# Altium schematic sheet Master-Slave.SchDoc: NEOS Master/Slave Electronics
size D; PageSetup: Record=PageOptions|CenterHorizontal=True|CenterVertical=True|PrintScale=0.34|XCorrection=1.00|YCorrection=1.00|PrintKind=1|BorderSize=5000000|LeftOffset=0|BottomOffset=0|Orientation=2|PaperLength=1000|PaperWidth=1000|Scale=100|PaperSource=15|PrintQuality=1200|MediaType=1|DitherType=10|PaperKind=Letter|PrintScaleMode=1
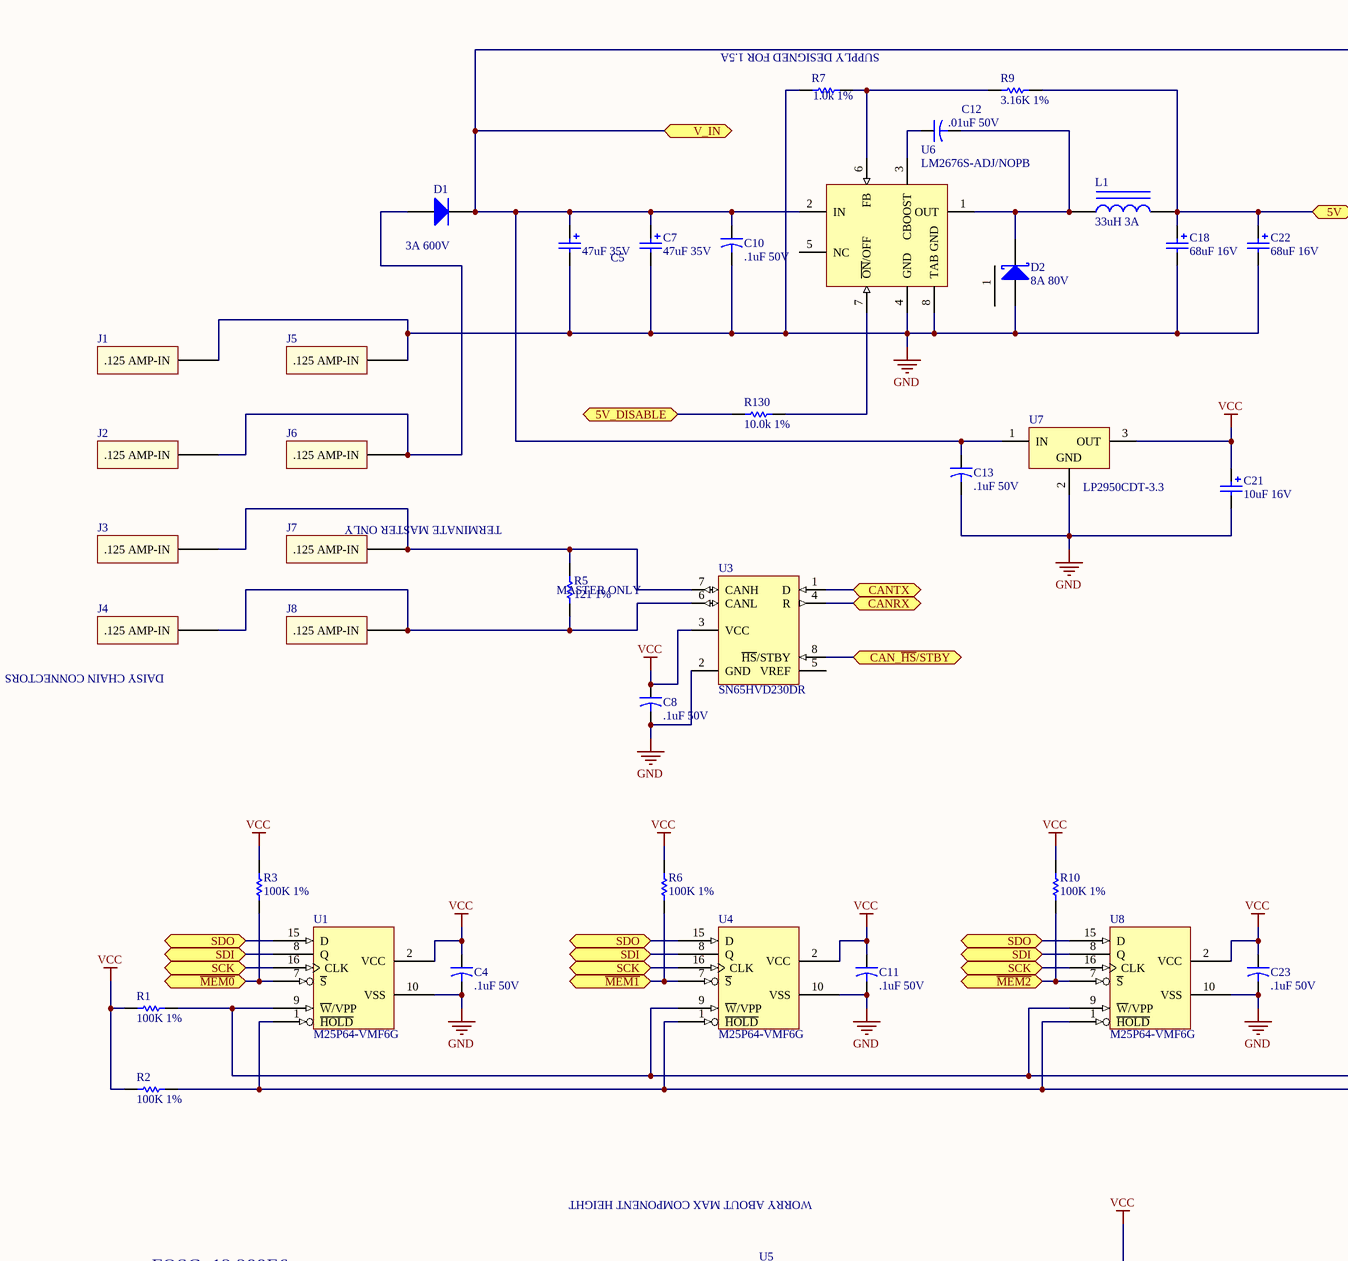
[diagram p0: Master-Slave.SchDoc, top left]
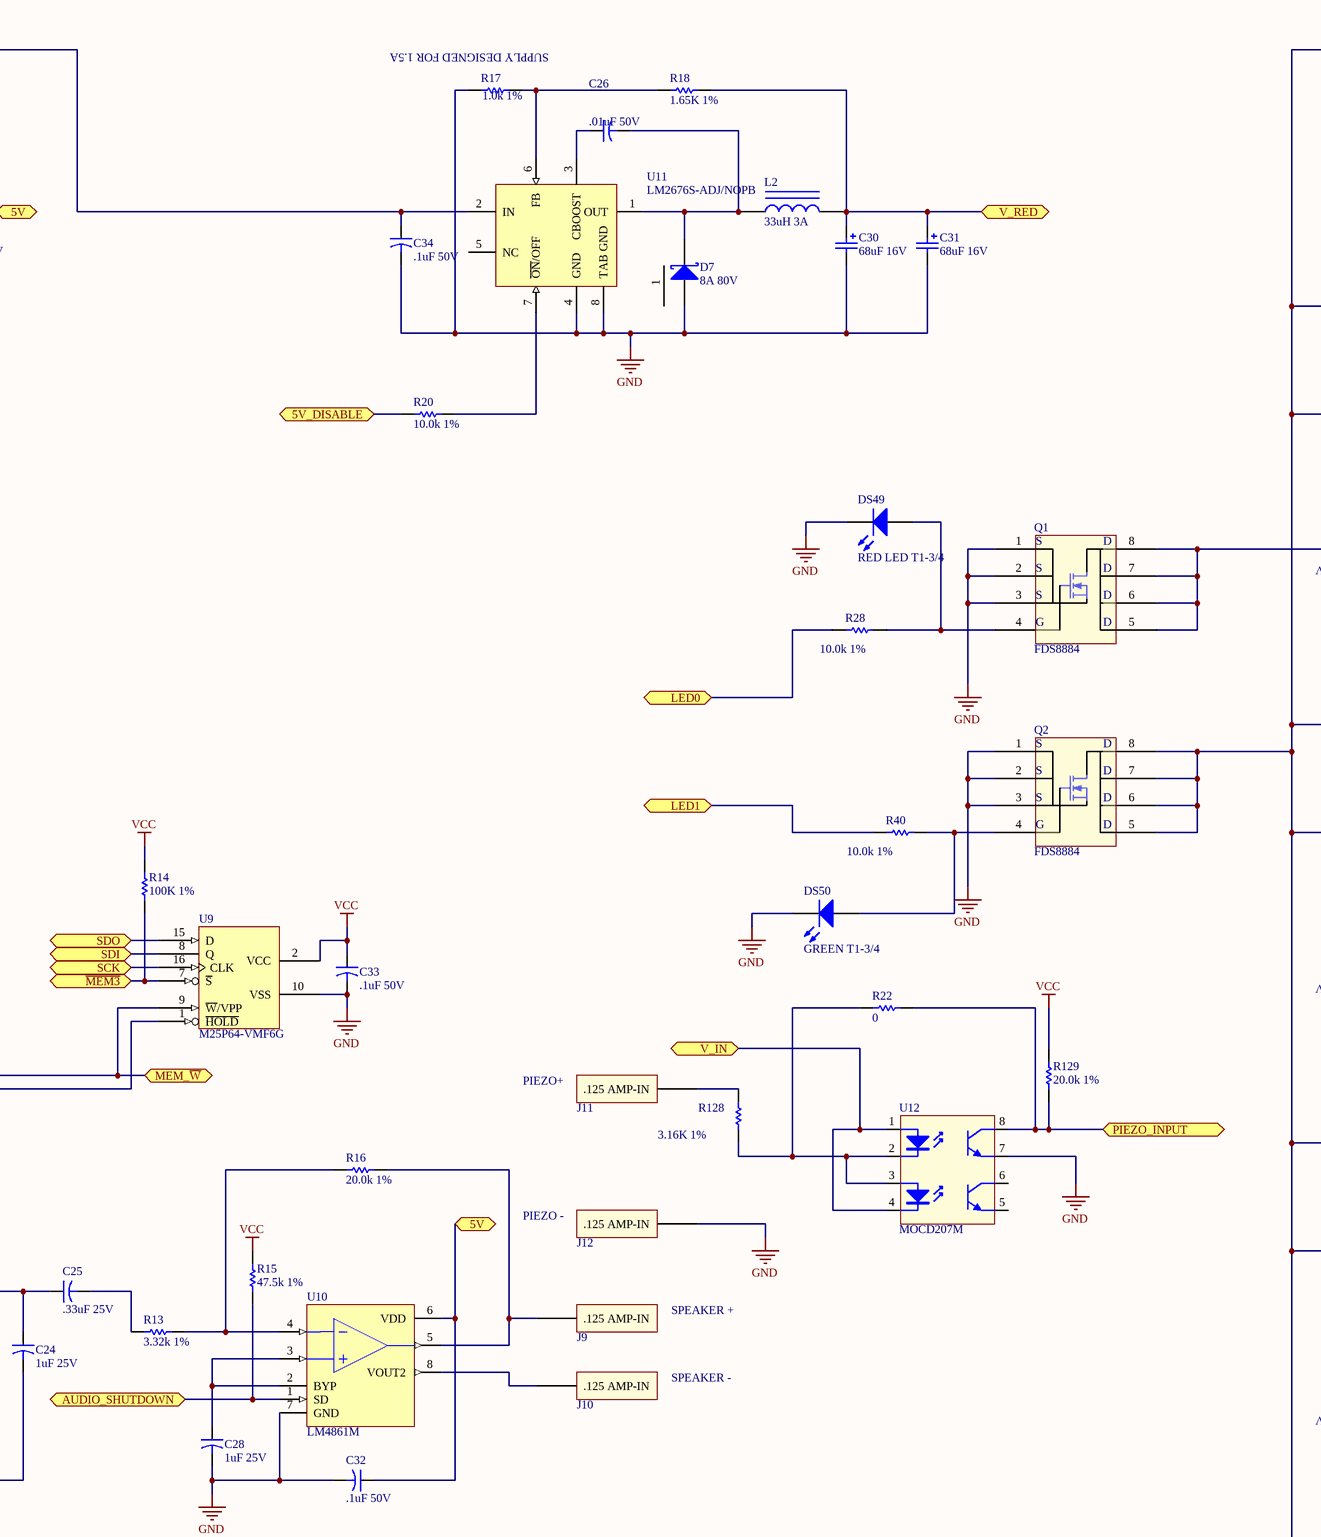
[diagram p1: Master-Slave.SchDoc, top middle]
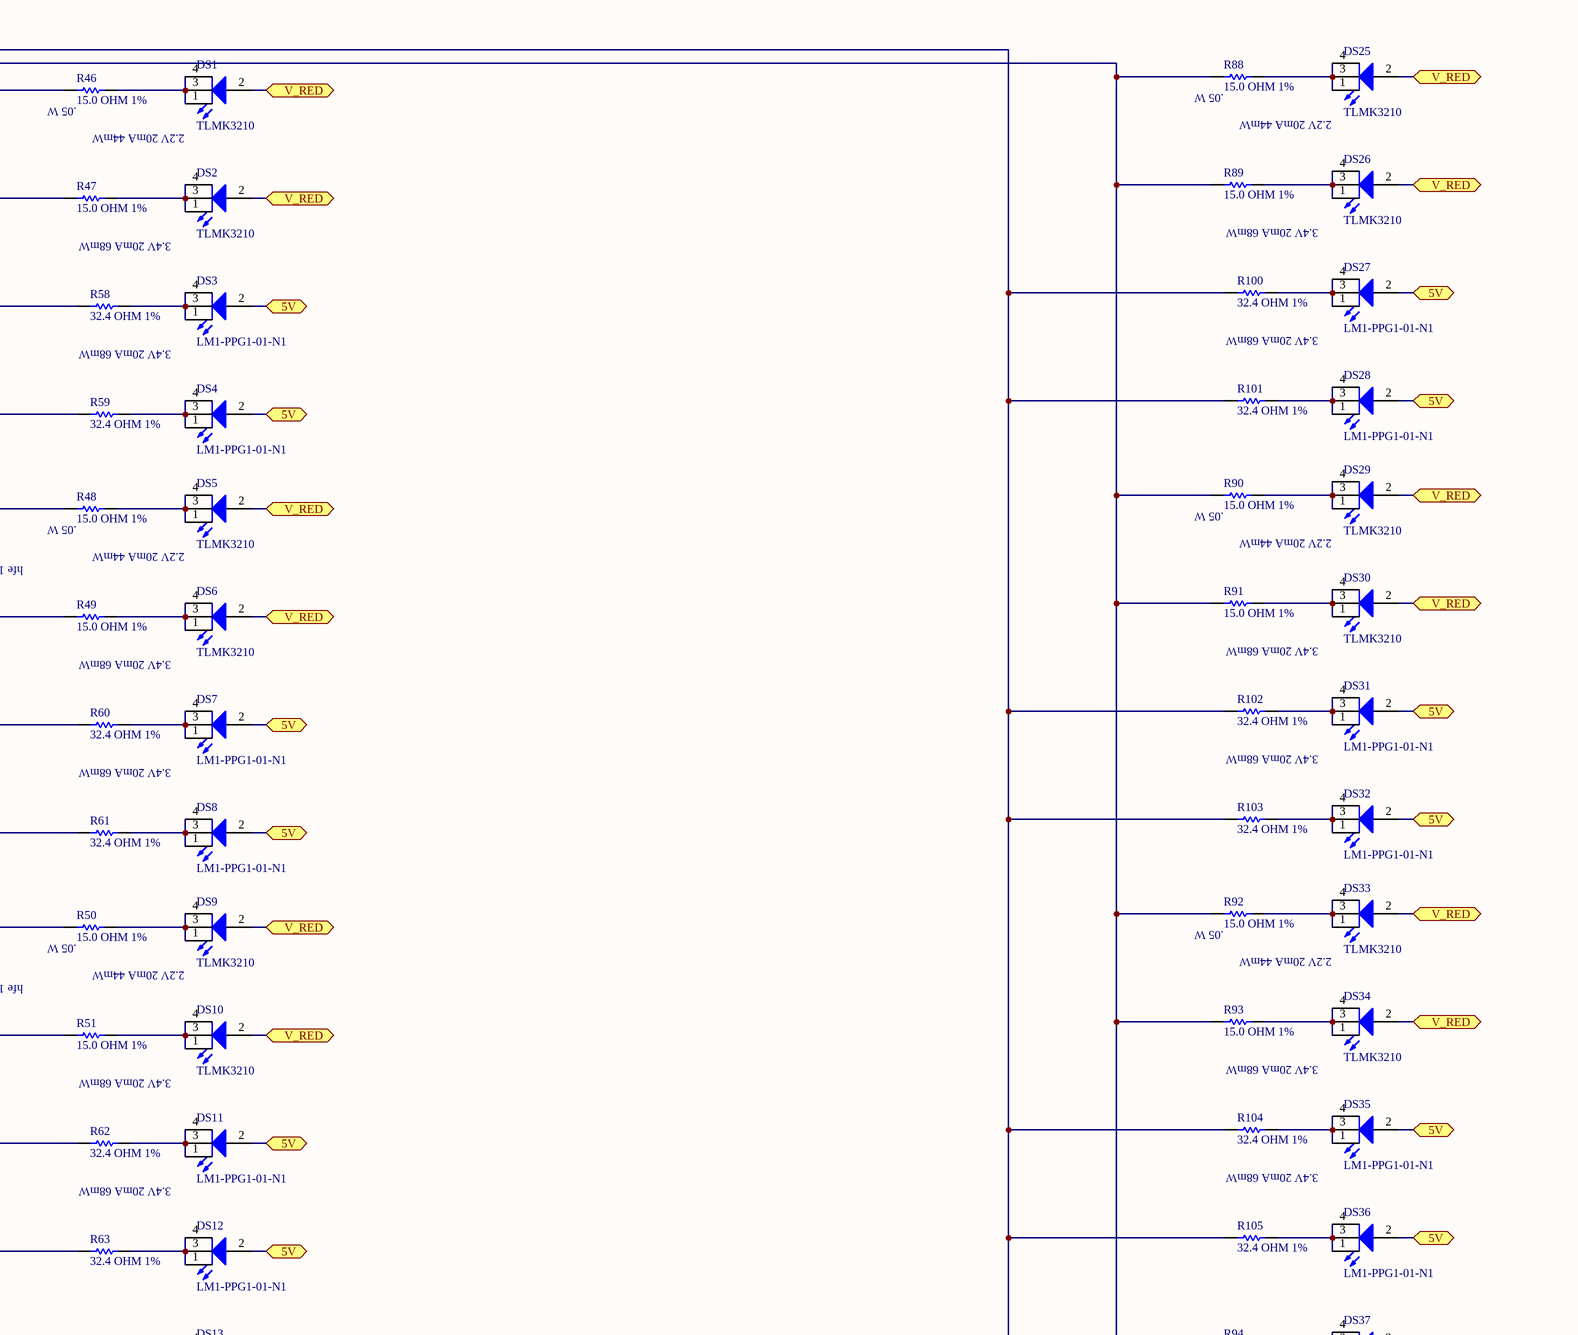
[diagram p2: Master-Slave.SchDoc, top right]
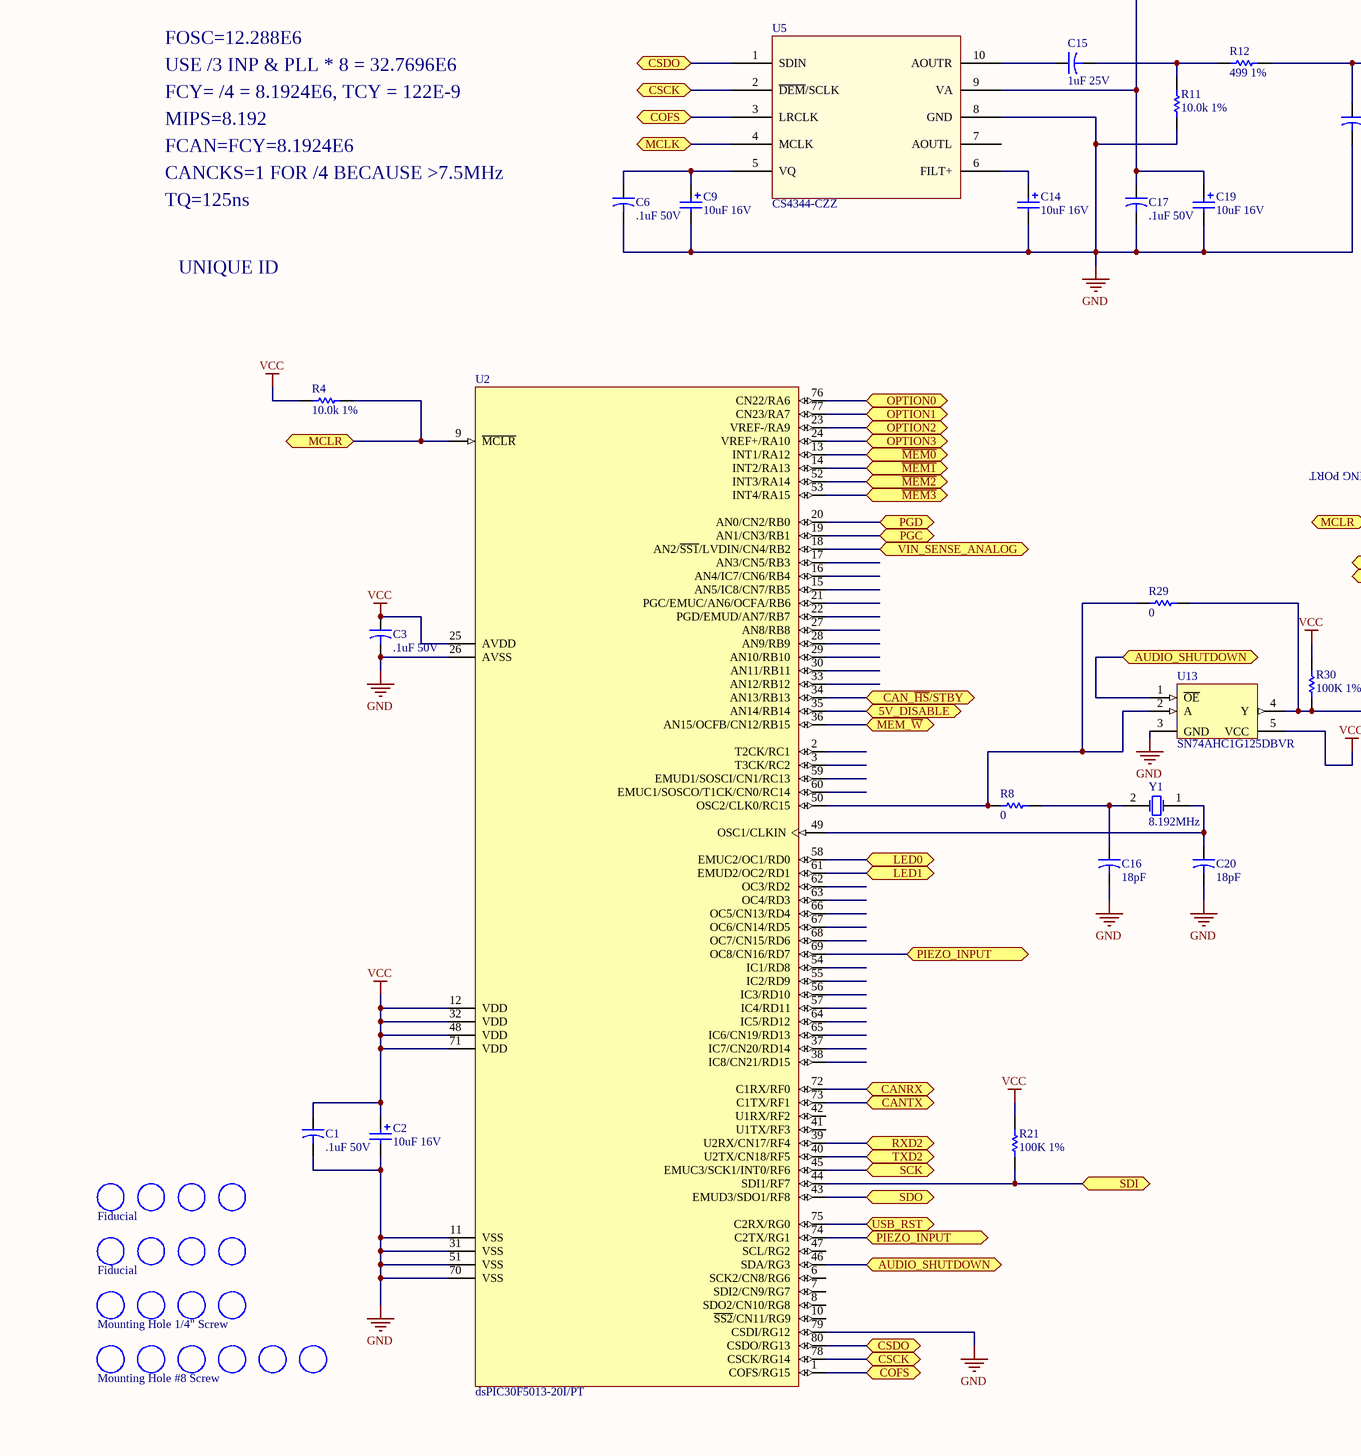
[diagram p3: Master-Slave.SchDoc, bottom left]
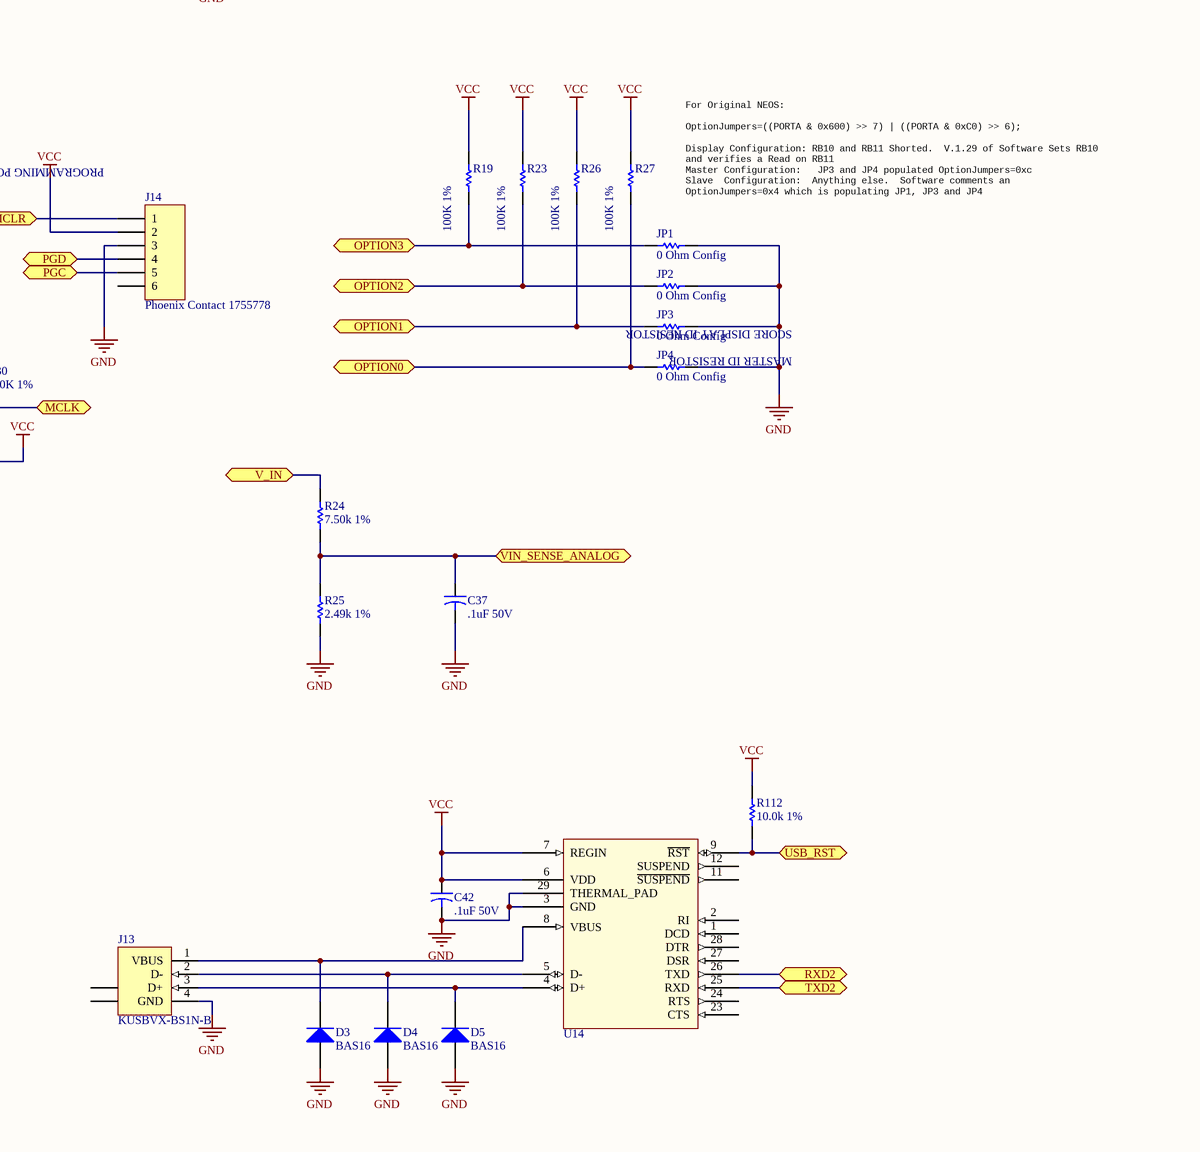
[diagram p4: Master-Slave.SchDoc, bottom middle]
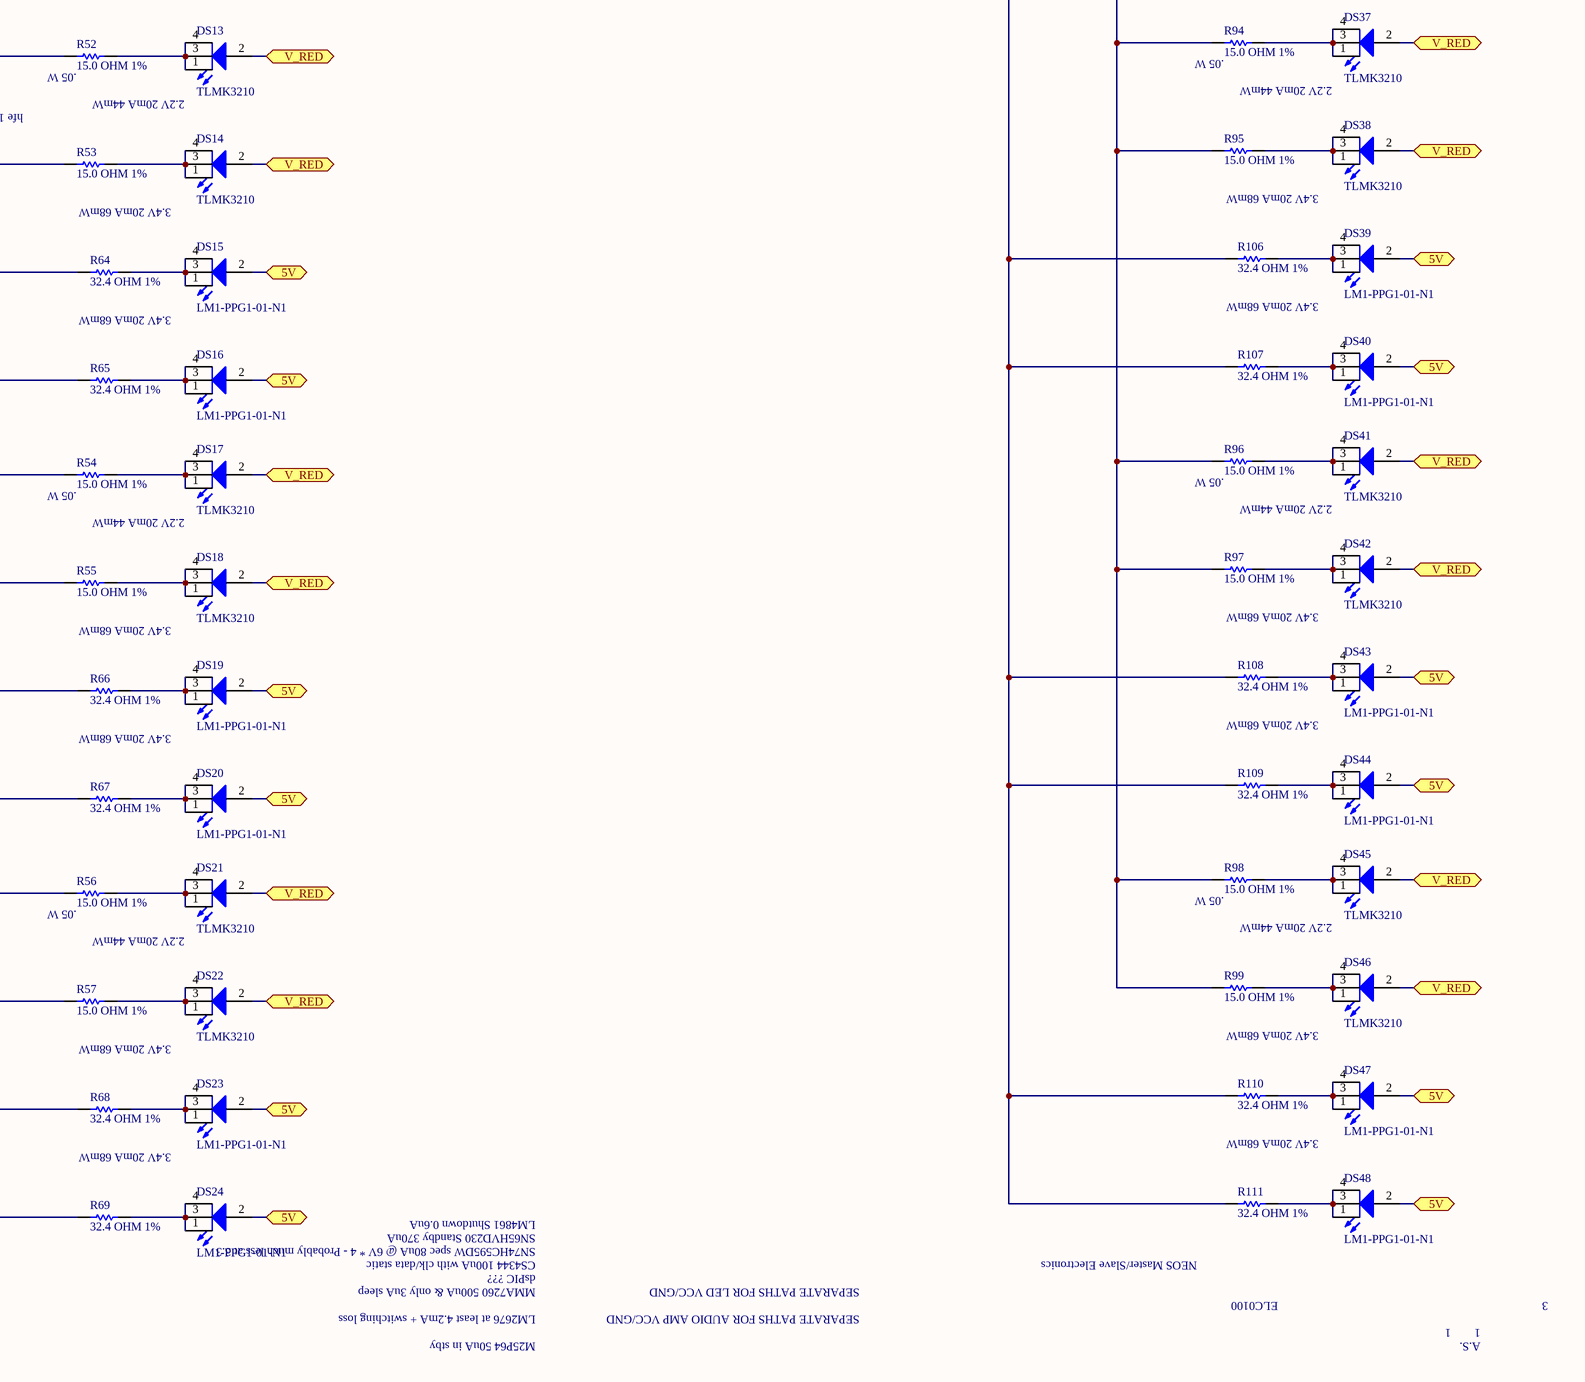
[diagram p5: Master-Slave.SchDoc, bottom right]

## Parts
C1  .1uF 50V  [C0805]
C2  10uF 16V  [C4X5.8]
C3  .1uF 50V  [C0805]
C4  .1uF 50V  [C0805]
C5  47uF 35V  [CAPACITOR TANT 47UF 35V 10% SMD 7343-43 (EIA]
C6  .1uF 50V  [C0805]
C7  47uF 35V  [CAPACITOR TANT 47UF 35V 10% SMD 7343-43 (EIA]
C8  .1uF 50V  [C0805]
C9  10uF 16V  [C4X5.8]
C10  .1uF 50V  [C0805]
C11  .1uF 50V  [C0805]
C12  .01uF 50V  [C0805]
C13  .1uF 50V  [C0805]
C14  10uF 16V  [C4X5.8]
C15  1uF 25V  [R1206]
C16  18pF  [C0805]
C17  .1uF 50V  [C0805]
C18  68uF 16V  [C7343]
C19  10uF 16V  [C4X5.8]
C20  18pF  [C0805]
C21  10uF 16V  [C4X5.8]
C22  68uF 16V  [C7343]
C23  .1uF 50V  [C0805]
C24  1uF 25V  [R1206]
C25  .33uF 25V  [R1206]
C26  .01uF 50V  [C0805]
C28  1uF 25V  [R1206]
C30  68uF 16V  [D]
C31  68uF 16V  [C7343]
C32  .1uF 50V  [C0805]
C33  .1uF 50V  [C0805]
C34  .1uF 50V  [C0805]
C37  .1uF 50V  [C0805]
C42  .1uF 50V  [C0805]
D1  value 3A 600V  [DIODE_SMC]  (hidden comment: DIODE ULTRA FAST 3A 600V SMC)
D2  8A 80V  [D2PAK]
D3  BAS16  [SOT23]
D4  BAS16  [SOT23]
D5  BAS16  [SOT23]
D7  8A 80V  [D2PAK]
DS1  TLMK3210  [L#S/TLMK3210Z]
DS2  TLMK3210  [L#S/TLMK3210Z]
DS3  LM1-PPG1-01-N1  [L#S/TLMK3210Z]
DS4  LM1-PPG1-01-N1  [L#S/TLMK3210Z]
DS5  TLMK3210  [L#S/TLMK3210Z]
DS6  TLMK3210  [L#S/TLMK3210Z]
DS7  LM1-PPG1-01-N1  [L#S/TLMK3210Z]
DS8  LM1-PPG1-01-N1  [L#S/TLMK3210Z]
DS9  TLMK3210  [L#S/TLMK3210Z]
DS10  TLMK3210  [L#S/TLMK3210Z]
DS11  LM1-PPG1-01-N1  [L#S/TLMK3210Z]
DS12  LM1-PPG1-01-N1  [L#S/TLMK3210Z]
DS13  TLMK3210  [L#S/TLMK3210Z]
DS14  TLMK3210  [L#S/TLMK3210Z]
DS15  LM1-PPG1-01-N1  [L#S/TLMK3210Z]
DS16  LM1-PPG1-01-N1  [L#S/TLMK3210Z]
DS17  TLMK3210  [L#S/TLMK3210Z]
DS18  TLMK3210  [L#S/TLMK3210Z]
DS19  LM1-PPG1-01-N1  [L#S/TLMK3210Z]
DS20  LM1-PPG1-01-N1  [L#S/TLMK3210Z]
DS21  TLMK3210  [L#S/TLMK3210Z]
DS22  TLMK3210  [L#S/TLMK3210Z]
DS23  LM1-PPG1-01-N1  [L#S/TLMK3210Z]
DS24  LM1-PPG1-01-N1  [L#S/TLMK3210Z]
DS25  TLMK3210  [L#S/TLMK3210Z]
DS26  TLMK3210  [L#S/TLMK3210Z]
DS27  LM1-PPG1-01-N1  [L#S/TLMK3210Z]
DS28  LM1-PPG1-01-N1  [L#S/TLMK3210Z]
DS29  TLMK3210  [L#S/TLMK3210Z]
DS30  TLMK3210  [L#S/TLMK3210Z]
DS31  LM1-PPG1-01-N1  [L#S/TLMK3210Z]
DS32  LM1-PPG1-01-N1  [L#S/TLMK3210Z]
DS33  TLMK3210  [L#S/TLMK3210Z]
DS34  TLMK3210  [L#S/TLMK3210Z]
DS35  LM1-PPG1-01-N1  [L#S/TLMK3210Z]
DS36  LM1-PPG1-01-N1  [L#S/TLMK3210Z]
DS37  TLMK3210  [L#S/TLMK3210Z]
DS38  TLMK3210  [L#S/TLMK3210Z]
DS39  LM1-PPG1-01-N1  [L#S/TLMK3210Z]
DS40  LM1-PPG1-01-N1  [L#S/TLMK3210Z]
DS41  TLMK3210  [L#S/TLMK3210Z]
DS42  TLMK3210  [L#S/TLMK3210Z]
DS43  LM1-PPG1-01-N1  [L#S/TLMK3210Z]
DS44  LM1-PPG1-01-N1  [L#S/TLMK3210Z]
DS45  TLMK3210  [L#S/TLMK3210Z]
DS46  TLMK3210  [L#S/TLMK3210Z]
DS47  LM1-PPG1-01-N1  [L#S/TLMK3210Z]
DS48  LM1-PPG1-01-N1  [L#S/TLMK3210Z]
DS49  RED LED T1-3/4  [LED T1-3/4 Flush]
DS50  GREEN T1-3/4  [LED T1-3/4 Flush]
FID1  Fiducial  [Fiducial]  (no BOM)
FID2  Fiducial  [Fiducial]  (value not drawn)  (no BOM)
FID3  Fiducial  [Fiducial]  (value not drawn)  (no BOM)
FID4  Fiducial  [Fiducial]  (value not drawn)  (no BOM)
FID5  Fiducial  [Fiducial]  (no BOM)
FID6  Fiducial  [Fiducial]  (value not drawn)  (no BOM)
FID7  Fiducial  [Fiducial]  (value not drawn)  (no BOM)
FID8  Fiducial  [Fiducial]  (value not drawn)  (no BOM)
J1  *  [WIRE_125]  (value not drawn)  (no BOM)
J2  *  [WIRE_125]  (value not drawn)  (no BOM)
J3  *  [WIRE_125]  (value not drawn)  (no BOM)
J4  *  [WIRE_125]  (value not drawn)  (no BOM)
J5  *  [WIRE_125]  (value not drawn)  (no BOM)
J6  *  [WIRE_125]  (value not drawn)  (no BOM)
J7  *  [WIRE_125]  (value not drawn)  (no BOM)
J8  *  [WIRE_125]  (value not drawn)  (no BOM)
J9  *  [WIRE_125]  (value not drawn)  (no BOM)
J10  *  [WIRE_125]  (value not drawn)  (no BOM)
J11  *  [WIRE_125]  (value not drawn)  (no BOM)
J12  *  [WIRE_125]  (value not drawn)  (no BOM)
J13  KUSBVX-BS1N-B  [KUSBVX-BS1N]
J14  Phoenix Contact 1755778  [JCPM5086VE0Z]
JP1  0 Ohm Config
JP2  0 Ohm Config
JP3  0 Ohm Config
JP4  0 Ohm Config  [0805]
L1  33uH 3A  [IND/DO5022]
L2  33uH 3A  [IND/DO5022]
M1  Mounting Hole 1/4" Screw  [MHole250]  (no BOM)
M2  Mounting Hole 1/4" Screw  [MHole250]  (value not drawn)  (no BOM)
M3  Mounting Hole 1/4" Screw  [MHole250]  (value not drawn)  (no BOM)
M4  Mounting Hole 1/4" Screw  [MHole250]  (value not drawn)  (no BOM)
M5  Mounting Hole #8 Screw  [MHole#8]  (no BOM)
M6  Mounting Hole #8 Screw  [MHole#8]  (value not drawn)  (no BOM)
M7  Mounting Hole #8 Screw  [MHole#8]  (value not drawn)  (no BOM)
M8  Mounting Hole #8 Screw  [MHole#8]  (value not drawn)  (no BOM)
M9  Mounting Hole #8 Screw  [MHole#8]  (value not drawn)  (no BOM)
M10  Mounting Hole #8 Screw  [MHole#8]  (value not drawn)  (no BOM)
Q1  FDS8884  [SO8]
Q2  FDS8884  [SO8]
R1  100K 1%  [R0805]
R2  100K 1%  [R0805]
R3  100K 1%  [R0805]
R4  10.0k 1%  [R0805]
R5  121 1%  [R1206]
R6  100K 1%  [R0805]
R7  1.0k 1%  [R0805]
R8  0  [R0805]
R9  3.16K 1%  [R0805]
R10  100K 1%  [R0805]
R11  10.0k 1%  [R0805]
R12  499 1%  [R0805]
R13  3.32k 1%  [R0805]
R14  100K 1%  [R0805]
R15  47.5k 1%  [R0805]
R16  20.0k 1%  [R0805]
R17  1.0k 1%  [R0805]
R18  1.65K 1%  [R0805]
R19  100K 1%  [R0805]
R20  10.0k 1%  [R0805]
R21  100K 1%  [R0805]
R22  0  [R0805]
R23  100K 1%  [R0805]
R24  7.50k 1%  [R0805]
R25  2.49k 1%
R26  100K 1%  [R0805]
R27  100K 1%  [R0805]
R28  10.0k 1%  [R0805]
R29  0  [R0805]
R30  100K 1%  [R0805]
R40  10.0k 1%  [R0805]
R46  15.0 OHM 1%  [R1206]
R47  15.0 OHM 1%  [R1206]
R48  15.0 OHM 1%  [R1206]
R49  15.0 OHM 1%  [R1206]
R50  15.0 OHM 1%  [R1206]
R51  15.0 OHM 1%  [R1206]
R52  15.0 OHM 1%  [R1206]
R53  15.0 OHM 1%  [R1206]
R54  15.0 OHM 1%  [R1206]
R55  15.0 OHM 1%  [R1206]
R56  15.0 OHM 1%  [R1206]
R57  15.0 OHM 1%  [R1206]
R58  32.4 OHM 1%  [R1206]
R59  32.4 OHM 1%  [R1206]
R60  32.4 OHM 1%  [R1206]
R61  32.4 OHM 1%  [R1206]
R62  32.4 OHM 1%  [R1206]
R63  32.4 OHM 1%  [R1206]
R64  32.4 OHM 1%  [R1206]
R65  32.4 OHM 1%  [R1206]
R66  32.4 OHM 1%  [R1206]
R67  32.4 OHM 1%  [R1206]
R68  32.4 OHM 1%  [R1206]
R69  32.4 OHM 1%  [R1206]
R88  15.0 OHM 1%  [R1206]
R89  15.0 OHM 1%  [R1206]
R90  15.0 OHM 1%  [R1206]
R91  15.0 OHM 1%  [R1206]
R92  15.0 OHM 1%  [R1206]
R93  15.0 OHM 1%  [R1206]
R94  15.0 OHM 1%  [R1206]
R95  15.0 OHM 1%  [R1206]
R96  15.0 OHM 1%  [R1206]
R97  15.0 OHM 1%  [R1206]
R98  15.0 OHM 1%  [R1206]
R99  15.0 OHM 1%  [R1206]
R100  32.4 OHM 1%  [R1206]
R101  32.4 OHM 1%  [R1206]
R102  32.4 OHM 1%  [R1206]
R103  32.4 OHM 1%  [R1206]
R104  32.4 OHM 1%  [R1206]
R105  32.4 OHM 1%  [R1206]
R106  32.4 OHM 1%  [R1206]
R107  32.4 OHM 1%  [R1206]
R108  32.4 OHM 1%  [R1206]
R109  32.4 OHM 1%  [R1206]
R110  32.4 OHM 1%  [R1206]
R111  32.4 OHM 1%  [R1206]
R112  10.0k 1%  [R0805]
R128  3.16K 1%  [R0805]
R129  20.0k 1%  [R0805]
R130  10.0k 1%  [R0805]
U1  M25P64-VMF6G  [so16w]
U2  dsPIC30F5013-20I/PT  [TQFP-80]
U3  SN65HVD230DR  [SOIC 8]
U4  M25P64-VMF6G  [so16w]
U5  CS4344-CZZ  [TSSOP\10]
U6  LM2676S-ADJ/NOPB  [TO263\7]
U7  LP2950CDT-3.3  [D-PAK / TO-252AA]
U8  M25P64-VMF6G  [so16w]
U9  M25P64-VMF6G  [so16w]
U10  LM4861M  [M08A]
U11  LM2676S-ADJ/NOPB  [TO263\7]
U12  MOCD207M  [SOIC 8]
U13  SN74AHC1G125DBVR  [SOT23-5]
U14  IC USB-TO-UART BRIDGE 28MLP  [QFN-28]  (value not drawn)
Y1  8.192MHz  [XTSL\CSM-7]

## Ports
5V, 5V_DISABLE, AUDIO_SHUTDOWN, CAN_~{HS}/STBY, CANRX, CANTX, COFS, CSCK, CSDO, LED0, LED1, MCLK, MCLR, MEM_~{W}, OPTION0, OPTION1, OPTION2, OPTION3, PGC, PGD, PIEZO_INPUT, RXD2, SCK, SDI, SDO, TXD2, USB_RST, V_IN, V_RED, VIN_SENSE_ANALOG, ~{MEM0}, ~{MEM1}, ~{MEM2}, ~{MEM3}

## Nets
GND: C1.2 C2.2 C3.2 C4.2 C5.2 C6.2 C7.2 C8.2 C9.2 C10.2 C11.2 C13.2 C14.2 C16.2 C17.2 C18.2 C19.2 C20.2 C21.2 C22.2 C23.2 C24.2 C28.2 C30.2 C31.2 C32.2 C33.2 C34.2 C37.2 C42.2 D2.3(A) D3.1(A) D4.1(A) D5.1(A) D7.3(A) DS49.2(K) DS50.2(K) J1.1(.125_AMP-IN) J5.1(.125_AMP-IN) J12.1(.125_AMP-IN) J13.4(GND) J14.3 JP1.2 JP2.2 JP3.2 JP4.2 Q1.1(S) Q1.2(S) Q1.3(S) Q2.1(S) Q2.2(S) Q2.3(S) R7.1 R11.1 R17.1 R25.1 U1.10(VSS) U2.11(VSS) U2.26(AVSS) U2.31(VSS) U2.51(VSS) U2.70(VSS) U2.79(CSDI/RG12) U3.2(GND) U4.10(VSS) U5.8(GND) U6.4(GND) U6.8(TAB_GND) U7.2(GND) U8.10(VSS) U9.10(VSS) U10.7(GND) U11.4(GND) U11.8(TAB_GND) U12.7 U13.3(GND) U14.3(GND) U14.29(THERMAL_PAD)
VCC: C1.1 C2.1 C3.1 C4.1 C8.1 C11.1 C17.1 C19.1 C21.1 C23.1 C33.1 C42.1 J14.2 R1.1 R2.1 R3.2 R4.2 R6.2 R10.2 R14.2 R15.2 R19.2 R21.2 R23.2 R26.2 R27.2 R30.2 R112.2 R129.2 U1.2(VCC) U2.12(VDD) U2.25(AVDD) U2.32(VDD) U2.48(VDD) U2.71(VDD) U3.3(VCC) U4.2(VCC) U5.9(VA) U7.3(OUT) U8.2(VCC) U9.2(VCC) U13.5(VCC) U14.6(VDD) U14.7(REGIN)
5V: C18.1 C22.1 C32.1 DS3.2(A) DS4.2(A) DS7.2(A) DS8.2(A) DS11.2(A) DS12.2(A) DS15.2(A) DS16.2(A) DS19.2(A) DS20.2(A) DS23.2(A) DS24.2(A) DS27.2(A) DS28.2(A) DS31.2(A) DS32.2(A) DS35.2(A) DS36.2(A) DS39.2(A) DS40.2(A) DS43.2(A) DS44.2(A) DS47.2(A) DS48.2(A) L1.2 R9.2 U10.6(VDD) ; port 5V
5V_DISABLE: R20.1 R130.1 U2.35(AN14/RB14) ; port 5V_DISABLE
AUDIO_SHUTDOWN: R15.1 U2.46(SDA/RG3) U10.1(SD) U13.1(~{OE}) ; port AUDIO_SHUTDOWN
CAN_~{HS}/STBY: U2.34(AN13/RB13) U3.8(~{HS}/STBY) ; port CAN_~{HS}/STBY
CANRX: U2.72(C1RX/RF0) U3.4(R) ; port CANRX
CANTX: U2.73(C1TX/RF1) U3.1(D) ; port CANTX
COFS: U2.1(COFS/RG15) U5.3(LRCLK) ; port COFS
CSCK: U2.78(CSCK/RG14) U5.2(~{DEM}/SCLK) ; port CSCK
CSDO: U2.80(CSDO/RG13) U5.1(SDIN) ; port CSDO
LED0: R28.1 U2.58(EMUC2/OC1/RD0) ; port LED0
LED1: R40.1 U2.61(EMUD2/OC2/RD1) ; port LED1
~{MEM0}: R3.1 U1.7(~{S}) U2.13(INT1/RA12) ; port ~{MEM0}
~{MEM1}: R6.1 U2.14(INT2/RA13) U4.7(~{S}) ; port ~{MEM1}
~{MEM2}: R10.1 U2.52(INT3/RA14) U8.7(~{S}) ; port ~{MEM2}
~{MEM3}: R14.1 U2.53(INT4/RA15) U9.7(~{S}) ; port ~{MEM3}
MCLK: R29.2 R30.1 U5.4(MCLK) U13.4(Y) ; port MCLK
MCLR: J14.1 R4.1 U2.9(~{MCLR}) ; port MCLR
MEM_~{W}: R1.2 U1.9(~{W}/VPP) U2.36(AN15/OCFB/CN12/RB15) U4.9(~{W}/VPP) U8.9(~{W}/VPP) U9.9(~{W}/VPP) ; port MEM_~{W}
OPTION0: JP4.1 R27.1 U2.76(CN22/RA6) ; port OPTION0
OPTION1: JP3.1 R26.1 U2.77(CN23/RA7) ; port OPTION1
OPTION2: JP2.1 R23.1 U2.23(VREF-/RA9) ; port OPTION2
OPTION3: JP1.1 R19.1 U2.24(VREF+/RA10) ; port OPTION3
PGC: J14.5 U2.19(AN1/CN3/RB1) ; port PGC
PGD: J14.4 U2.20(AN0/CN2/RB0) ; port PGD
PIEZO_INPUT: R22.2 R129.1 U2.69(OC8/CN16/RD7) U2.74(C2TX/RG1) U12.8 ; port PIEZO_INPUT
RXD2: U2.39(U2RX/CN17/RF4) U14.26(TXD) ; port RXD2
SCK: U1.16(CLK) U2.45(EMUC3/SCK1/INT0/RF6) U4.16(CLK) U8.16(CLK) U9.16(CLK) ; port SCK
SDI: R21.1 U1.8(Q) U2.44(SDI1/RF7) U4.8(Q) U8.8(Q) U9.8(Q) ; port SDI
SDO: U1.15(D) U2.43(EMUD3/SDO1/RF8) U4.15(D) U8.15(D) U9.15(D) ; port SDO
TXD2: U2.40(U2TX/CN18/RF5) U14.25(RXD) ; port TXD2
USB_RST: R112.1 U2.75(C2RX/RG0) U14.9(~{RST}) ; port USB_RST
V_IN: C5.1 C7.1 C10.1 C13.1 C34.1 D1.K R24.2 U6.2(IN) U7.1(IN) U11.2(IN) U12.1 U12.4 ; port V_IN
V_RED: C30.1 C31.1 DS1.2(A) DS2.2(A) DS5.2(A) DS6.2(A) DS9.2(A) DS10.2(A) DS13.2(A) DS14.2(A) DS17.2(A) DS18.2(A) DS21.2(A) DS22.2(A) DS25.2(A) DS26.2(A) DS29.2(A) DS30.2(A) DS33.2(A) DS34.2(A) DS37.2(A) DS38.2(A) DS41.2(A) DS42.2(A) DS45.2(A) DS46.2(A) L2.2 R18.2 ; port V_RED
VIN_SENSE_ANALOG: C37.1 R24.1 R25.2 U2.18(AN2/~{SS1}/LVDIN/CN4/RB2) ; port VIN_SENSE_ANALOG
NetC6_1: C6.1 C9.1 U5.5(VQ)
NetC12_1: C12.1 U6.3(CBOOST)
NetC12_2: C12.2 D2.2(K) L1.1 U6.1(OUT)
NetC14_1: C14.1 U5.6(FILT+)
NetC15_1: C15.1 U5.10(AOUTR)
NetC15_2: C15.2 R11.2 R12.1
NetC16_1: C16.1 R8.2 Y1.2(OSC2)
NetC20_1: C20.1 U2.49(OSC1/CLKIN) Y1.1(OSC1)
NetC24_1: C24.1 C25.1 R12.2
NetC25_2: C25.2 R13.1
NetC26_1: C26.1 U11.3(CBOOST)
NetC26_2: C26.2 D7.2(K) L2.1 U11.1(OUT)
NetC28_1: C28.1 U10.2(BYP) U10.3(IN+)
NetD1_A: D1.A J2.1(.125_AMP-IN) J6.1(.125_AMP-IN)
NetD3_3: D3.3(K) J13.1(VBUS) U14.8(VBUS)
NetD4_3: D4.3(K) J13.2(D-) U14.5(D-)
NetD5_3: D5.3(K) J13.3(D+) U14.4(D+)
NetDS1_1: DS1.1(K) DS1.3(K) DS1.4(K) R46.2
NetDS2_1: DS2.1(K) DS2.3(K) DS2.4(K) R47.2
NetDS3_1: DS3.1(K) DS3.3(K) DS3.4(K) R58.2
NetDS4_1: DS4.1(K) DS4.3(K) DS4.4(K) R59.2
NetDS5_1: DS5.1(K) DS5.3(K) DS5.4(K) R48.2
NetDS6_1: DS6.1(K) DS6.3(K) DS6.4(K) R49.2
NetDS7_1: DS7.1(K) DS7.3(K) DS7.4(K) R60.2
NetDS8_1: DS8.1(K) DS8.3(K) DS8.4(K) R61.2
NetDS9_1: DS9.1(K) DS9.3(K) DS9.4(K) R50.2
NetDS10_1: DS10.1(K) DS10.3(K) DS10.4(K) R51.2
NetDS11_1: DS11.1(K) DS11.3(K) DS11.4(K) R62.2
NetDS12_1: DS12.1(K) DS12.3(K) DS12.4(K) R63.2
NetDS13_1: DS13.1(K) DS13.3(K) DS13.4(K) R52.2
NetDS14_1: DS14.1(K) DS14.3(K) DS14.4(K) R53.2
NetDS15_1: DS15.1(K) DS15.3(K) DS15.4(K) R64.2
NetDS16_1: DS16.1(K) DS16.3(K) DS16.4(K) R65.2
NetDS17_1: DS17.1(K) DS17.3(K) DS17.4(K) R54.2
NetDS18_1: DS18.1(K) DS18.3(K) DS18.4(K) R55.2
NetDS19_1: DS19.1(K) DS19.3(K) DS19.4(K) R66.2
NetDS20_1: DS20.1(K) DS20.3(K) DS20.4(K) R67.2
NetDS21_1: DS21.1(K) DS21.3(K) DS21.4(K) R56.2
NetDS22_1: DS22.1(K) DS22.3(K) DS22.4(K) R57.2
NetDS23_1: DS23.1(K) DS23.3(K) DS23.4(K) R68.2
NetDS24_1: DS24.1(K) DS24.3(K) DS24.4(K) R69.2
NetDS25_1: DS25.1(K) DS25.3(K) DS25.4(K) R88.2
NetDS26_1: DS26.1(K) DS26.3(K) DS26.4(K) R89.2
NetDS27_1: DS27.1(K) DS27.3(K) DS27.4(K) R100.2
NetDS28_1: DS28.1(K) DS28.3(K) DS28.4(K) R101.2
NetDS29_1: DS29.1(K) DS29.3(K) DS29.4(K) R90.2
NetDS30_1: DS30.1(K) DS30.3(K) DS30.4(K) R91.2
NetDS31_1: DS31.1(K) DS31.3(K) DS31.4(K) R102.2
NetDS32_1: DS32.1(K) DS32.3(K) DS32.4(K) R103.2
NetDS33_1: DS33.1(K) DS33.3(K) DS33.4(K) R92.2
NetDS34_1: DS34.1(K) DS34.3(K) DS34.4(K) R93.2
NetDS35_1: DS35.1(K) DS35.3(K) DS35.4(K) R104.2
NetDS36_1: DS36.1(K) DS36.3(K) DS36.4(K) R105.2
NetDS37_1: DS37.1(K) DS37.3(K) DS37.4(K) R94.2
NetDS38_1: DS38.1(K) DS38.3(K) DS38.4(K) R95.2
NetDS39_1: DS39.1(K) DS39.3(K) DS39.4(K) R106.2
NetDS40_1: DS40.1(K) DS40.3(K) DS40.4(K) R107.2
NetDS41_1: DS41.1(K) DS41.3(K) DS41.4(K) R96.2
NetDS42_1: DS42.1(K) DS42.3(K) DS42.4(K) R97.2
NetDS43_1: DS43.1(K) DS43.3(K) DS43.4(K) R108.2
NetDS44_1: DS44.1(K) DS44.3(K) DS44.4(K) R109.2
NetDS45_1: DS45.1(K) DS45.3(K) DS45.4(K) R98.2
NetDS46_1: DS46.1(K) DS46.3(K) DS46.4(K) R99.2
NetDS47_1: DS47.1(K) DS47.3(K) DS47.4(K) R110.2
NetDS48_1: DS48.1(K) DS48.3(K) DS48.4(K) R111.2
NetDS49_1: DS49.1(A) Q1.4(G) R28.2
NetDS50_1: DS50.1(A) Q2.4(G) R40.2
NetJ3_1: J3.1(.125_AMP-IN) J7.1(.125_AMP-IN) R5.2 U3.7(CANH)
NetJ4_1: J4.1(.125_AMP-IN) J8.1(.125_AMP-IN) R5.1 U3.6(CANL)
NetJ9_1: J9.1(.125_AMP-IN) R16.2 U10.5(VOUT1)
NetJ10_1: J10.1(.125_AMP-IN) U10.8(VOUT2)
NetJ11_1: J11.1(.125_AMP-IN) R128.1
NetQ1_5: Q1.5(D) Q1.6(D) Q1.7(D) Q1.8(D) R46.1 R47.1 R48.1 R49.1 R50.1 R51.1 R52.1 R53.1 R54.1 R55.1 R56.1 R57.1 R88.1 R89.1 R90.1 R91.1 R92.1 R93.1 R94.1 R95.1 R96.1 R97.1 R98.1 R99.1
NetQ2_5: Q2.5(D) Q2.6(D) Q2.7(D) Q2.8(D) R58.1 R59.1 R60.1 R61.1 R62.1 R63.1 R64.1 R65.1 R66.1 R67.1 R68.1 R69.1 R100.1 R101.1 R102.1 R103.1 R104.1 R105.1 R106.1 R107.1 R108.1 R109.1 R110.1 R111.1
NetR2_2: R2.2 U1.1(~{HOLD}) U4.1(~{HOLD}) U8.1(~{HOLD}) U9.1(~{HOLD})
NetR7_2: R7.2 R9.1 U6.6(FB)
NetR8_1: R8.1 R29.1 U2.50(OSC2/CLK0/RC15) U13.2(A)
NetR13_2: R13.2 R16.1 U10.4(IN-)
NetR17_2: R17.2 R18.1 U11.6(FB)
NetR20_2: R20.2 U11.7(~{ON}/OFF)
NetR22_1: R22.1 R128.2 U12.2 U12.3
NetR130_2: R130.2 U6.7(~{ON}/OFF)

Not connected (* = marked no-connect by the designer): D2 1(NC); D7 1(NC); J13 5(SHLD) 6(SHLD); J14 6; U2 2(T2CK/RC1) 3(T3CK/RC2) 6(SCK2/CN8/RG6) 7(SDI2/CN9/RG7) 8(SDO2/CN10/RG8) 10(~{SS2}/CN11/RG9) 15(AN5/IC8/CN7/RB5) 16(AN4/IC7/CN6/RB4) 17(AN3/CN5/RB3) 21(PGC/EMUC/AN6/OCFA/RB6) 22(PGD/EMUD/AN7/RB7) 27(AN8/RB8) 28(AN9/RB9) 29(AN10/RB10) 30(AN11/RB11) 33(AN12/RB12) 37(IC7/CN20/RD14) 38(IC8/CN21/RD15) 41(U1TX/RF3) 42(U1RX/RF2) 47(SCL/RG2) 54(IC1/RD8) 55(IC2/RD9) 56(IC3/RD10) 57(IC4/RD11) 59(EMUD1/SOSCI/CN1/RC13) 60(EMUC1/SOSCO/T1CK/CN0/RC14) 62(OC3/RD2) 63(OC4/RD3) 64(IC5/RD12) 65(IC6/CN19/RD13) 66(OC5/CN13/RD4) 67(OC6/CN14/RD5) 68(OC7/CN15/RD6); U3 5(VREF); U5 7(AOUTL); U6 5(NC); U11 5(NC); U12 5 6; U14 1(DCD) 2(RI) 11(~{SUSPEND}) 12(SUSPEND) 23(CTS) 24(RTS) 27(DSR) 28(DTR)

## Notes on the sheet
- (near R9) SUPPLY DESIGNED FOR 1.5A
- (near R18) SUPPLY DESIGNED FOR 1.5A
- (near R88) .05 W
- (near R46) .05 W
- 2.2V 20mA 44mW
- 3.4V 20mA 68mW
- (near R5) TERMINATE MASTER ONLY
- hfe 100+ 0.3V
- (near R48) .05 W
- (near R90) .05 W
- (near R5) MASTER ONLY
- (near J4) DAISY CHAIN CONNECTORS
- (near R50) .05 W
- (near R92) .05 W
- PIEZO+
- WORRY ABOUT MAX COMPONENT HEIGHT
- PIEZO -
- FOSC=12.288E6
- USE /3 INP & PLL * 8 = 32.7696E6
- FCY= /4 = 8.1924E6, TCY = 122E-9
- MIPS=8.192
- SPEAKER +
- (near R52) .05 W
- (near R94) .05 W
- FCAN=FCY=8.1924E6
- CANCKS=1 FOR /4 BECAUSE >7.5MHz
- TQ=125ns
- SPEAKER -
- UNIQUE ID
- (near J14) PROGRAMMING PORT
- (near JP1) For Original NEOS:
  OptionJumpers=((PORTA & 0x600) >> 7) | ((PORTA & 0xC0) >> 6);
  Display Configuration: RB10 and RB11 Shorted.  V.1.29 of Software Sets RB10 and verifies a Read on RB11
  Master Configuration:   JP3 and JP4 populated OptionJumpers=0xc
  Slave  Configuration:  Anything else.  Software comments an OptionJumpers=0x4 which is populating JP1, JP3 and JP4
- (near R96) .05 W
- (near R54) .05 W
- MASTER ID RESISTOR
- SCORE DISPLAY ID RESISTOR
- (near R56) .05 W
- (near R98) .05 W
- LM4861 Shutdown 0.6uA
- SN65HVD230 Standby 370uA
- SN74HC595DW spec 80uA @ 6V * 4 - Probably much less at 3.3
- CS4344 100uA with clk/data static
- dsPIC ???
- MMA7260 500uA & only 3uA sleep
- SEPARATE PATHS FOR LED VCC/GND
- NEOS Master/Slave Electronics
- M25P64 50uA in stby
- LM2676 at least 4.2mA + switching loss
- SEPARATE PATHS FOR AUDIO AMP VCC/GND
- ELC0100
- 1
- A.S.
- 3

## Library data of the parts
C1 C3 C4 C6 C8 C10 C11 C13 C17 C23 C32-C34 C37 C42 = C#S/C0805C104K5RACK: CAP .10UF 50V CERAMIC X7R 0805; Manufacturer: Kemet; Manufacturer Part Number: C0805C104K5RACTU; Source Part Number: 399-1170-1-ND; Source: Digikey; ROHS Certificate: ROHS-KEMET-CERAMIC.PDF; Value: CAP .10UF 50V CERAMIC X7R 0805
C2 C9 C19 C21 = C#S/EEEFK1C100RP: CAP ELECT 10UF 16V FK SMD; Manufacturer: Panasonic - ECG; Manufacturer Part Number: EEE-FK1C100R; Source Part Number: PCE3782CT-ND; Source: Digikey; ROHS Certificate: ROHS-PANASONIC.pdf; Value: CAP ELECT 10UF 16V FK SMD
C5 C7 = C#S/T491X476K035ATK: CAPACITOR TANT 47UF 35V 10% SMD 7343-43 (EIA); Manufacturer: Kemet; Source Part Number: 399-3821-1-ND; Value: 47uF 35V; Manufacturer Part Number: T491X476K035AT; Source: Digikey; ROHS Certificate: ROHS-KEMET-TANTALUM.pdf
  C7: Value: Value
C12 C26 = C#S/C0805C103K5RAC: CAP 10000PF 50V CERAMIC X7R 0805; Manufacturer: Kemet; Manufacturer Part Number: C0805C103K5RACTU; Source Part Number: 399-1158-1-ND; Source: Digikey; ROHS Certificate: ROHS-KEMET-CERAMIC.PDF; Value: CAP 10000PF 50V CERAMIC X7R 0805
C14 = CS/EEVFK1C100RP: CAP ELECT 10UF 16V FK SMD; Manufacturer: Panasonic - ECG; Manufacturer Part Number: EEE-FK1C100R; Source Part Number: PCE3782CT-ND; Source: Digikey; ROHS Certificate: ROHS-PANASONIC.pdf; Value: CAP ELECT 10UF 16V FK SMD
C15 C24 C28 = C#S/ECJ3YB1E105KP: CAP 1UF 25V CERAMIC X7R 1206; Manufacturer: Panasonic - ECG; Manufacturer Part Number: ECJ-3YB1E105K; Source Part Number: PCC1893CT-ND; Source: Digikey; ROHS Certificate: ROHS-PANASONIC.PDF; Value: CAP 1UF 25V CERAMIC X7R 1206
C16 C20 = C#S/C0805C180J5GACTUK: CAP CERAMIC 18PF 50V NP0 0805; Manufacturer: Kemet; Source Part Number: 399-1112-1-ND; Manufacturer Part Number: C0805C180J5GACTU; Source: Digikey; ROHS Certificate: ROHS-KEMET-CERAMIC.pdf; Value: CAP CERAMIC 18PF 50V NP0 0805
C18 C22 C30 C31 = C#S/T495D686K016ATEK: CAPACITOR TANT 68UF 16V 10% SMD; Manufacturer: Kemet; Manufacturer Part Number: T495D686K016ATE150; Source Part Number: 399-3889-1-ND; Value: CAPACITOR TANT 68UF 16V 10% SMD; Source: Digikey; ROHS Certificate: ROHS-KEMET-TANTALUM.pdf
  C22 C30: Value: Value
C25 = C#S/ECJ3VB1E334KP: CAP .33UF 25V CERAMIC X7R 1206; Manufacturer: Panasonic - ECG; Manufacturer Part Number: ECJ-3VB1E334K; Source Part Number: PCC1889CT-ND; Source: Digikey; ROHS Certificate: ROHS-PANASONIC.pdf; Value: CAP .33UF 25V CERAMIC X7R 1206
D1 = D#S/MURS360T3GM: Manufacturer: ON Semiconductor; Source Part Number: MURS360T3GOSCT-ND; Manufacturer Part Number: MURS360T3G; Source: Digikey; ROHS Certificate: ROHS-ON-SEMI.PDF
D2 D7 = D#S/8TQ080SPBFZ: DIODE SCHOTTKY 80V 8A D2PAK; Manufacturer: Vishay IR; Manufacturer Part Number: 8TQ100SPBF; Source Part Number: 844-8TQ100SPBF; Value: Schottky Rectifiers 8.0 Amp 100 Volt; Source: Digikey; ROHS Certificate: ROHS-IRF.pdf
D3-D5 = D#S/BAS167F0D: Diodes Inc BAS16 75V 200mA; Manufacturer Part Number: BAS16-7-F; Manufacturer: Diodes Inc; Source: Digikey; Source Part Number: BAS16-7-F; ROHS Certificate: ROHS-DIODES-INC.pdf; Value: Diodes Inc BAS16 75V 200mA
DS1 DS2 DS5 DS6 DS9 DS10 DS13 DS14 DS17 DS18 DS21 DS22 DS25 DS26 DS29 DS30 DS33 DS34 DS37 DS38 DS41 DS42 DS45 DS46 = L#S/TLMK3210: Vishay Red LED PLCC-3; Manufacturer Part Number: TLMK3210-GS08; Value: Power SMD LED Lamp AllnGaP PLCC-3 Red 2.2V 70mA 60 deg.; Manufacturer: Vishay; Source: Future; Source Part Number: TLMK3210-GS08; ROHS Certificate: ROHS-VISHAY.pdf
DS3 DS4 DS7 DS8 DS11 DS12 DS15 DS16 DS19 DS20 DS23 DS24 DS27 DS28 DS31 DS32 DS35 DS36 DS39 DS40 DS43 DS44 DS47 DS48 = L#S/LM1PPG103N1Z: 120-degree, 3.3 x 3.5-mm, SMT LED in green color with water-transparent lens; Manufacturer: Cree; Manufacturer Part Number: LM1-PPG1-01-N1; Source: Marktech Optoelectronics; Source Part Number: LM1-PPG1-01-N1; ROHS Certificate: ROHS-CREE.pdf; Value: 120-degree, 3.3 x 3.5-mm, SMT LED in green color with water-transparent lens
DS49 = LRCOVLFR3C7Z: LED 631NM TAPERED RED 5MM; Manufacturer: TT Electronics/Optek Technology; Manufacturer Part Number: OVLGS0C8B9; Source Part Number: 365-1189-ND; Source: Digikey; ROHS Certificate: ROHS-OPTEK.pdf; Value: LED 631NM TAPERED RED 5MM
DS50 = LGCOVLFG3C7Z: LED 525NM ROUND GREEN 5MM; Manufacturer: TT Electronics/Optek Technology; Source Part Number: 365-1181-ND; Manufacturer Part Number: OVLFG3C7; Source: Digikey; ROHS Certificate: ROHS-OPTEK.pdf; Value: LED 525NM ROUND GREEN 5MM
J1-J12 = ~125_WIRE: Manufacturer: Manufacturer; Manufacturer Part Number: Manufacturer Part Number; Source: Source; Source Part Number: Source Part Number; ROHS Certificate: ROHS Certificate; Value: Value
J13 = 787834-2: USB Connectors B TYPE VERT BLK SKT; Manufacturer: Kycon; Source Part Number: 806-KUSBVX-BS1N-B; Manufacturer Part Number: KUSBVX-BS1N-B; Source: Mouser; ROHS Certificate: ROHS-KYCON.pdf; Value: USB Connectors B TYPE VERT BLK SKT
J14 = JCPM5086VE0Z: CONN HEADER VERT 6POS 5.08MM; Source Part Number: 277-1154-ND; Manufacturer: Phoenix Contact; Manufacturer Part Number: 1755778; Source: Digikey; ROHS Certificate: ROHS-PHOENIX.pdf; Value: CONN HEADER VERT 6POS 5.08MM
JP1-JP4 = RS/ERJ6ENF: RES 0.0 OHM 1/8W 5% 0805 SMD; Manufacturer: Panasonic - ECG; Manufacturer Part Number: ERJ-6GEY0R00V; Source Part Number: P0.0ACT-ND; Value: RES 0.0 OHM 1/8W 5% 0805 SMD; Source: Digikey; ROHS Certificate: ROHS-PANASONIC.pdf
  JP1 JP2: Value: Value
L1 L2 = N#S/DO5022P333Z: 33uH 3A Surface Mount Inductor; Manufacturer: CoilCraft; Manufacturer Part Number: DO5022P-333MLB; Value: 33uH 3A Surface Mount; Source: CoilCraft; Source Part Number: DO5022P-333MLB; ROHS Certificate: ROHS-COILCRAFT-DO5022.pdf; Value: Value
M1-M4 = MountingHole_1/4: Manufacturer: Manufacturer; Manufacturer Part Number: Manufacturer Part Number; Source: Source; Source Part Number: Source Part Number; ROHS Certificate: ROHS Certificate; Value: Value
M5-M10 = MountingHole_8: Manufacturer: Manufacturer; Manufacturer Part Number: Manufacturer Part Number; Source: Source; Source Part Number: Source Part Number; ROHS Certificate: ROHS Certificate; Value: Value
Q1 Q2 = Q#S/FDS8884F: MOSFET N-CH 30V 8.5A 8-SOIC; Manufacturer: Fairchild Semiconductor; Source Part Number: FDS8884CT-ND; Manufacturer Part Number: FDS8884; Source: Digikey; ROHS Certificate: ROHS-FAIRCHILD.pdf; Value: MOSFET N-CH 30V 8.5A 8-SOIC
R1-R3 R6 R10 R14 R19 R21 R23 R26 R27 R30 = RS/ERJ6ENF: RES 100K OHM 1/8W 1% 0805 SMD; Manufacturer: Panasonic - ECG; Manufacturer Part Number: RC0805JR-07100KL; Source Part Number: 311-100KARCT-ND; Value: RES 100K OHM 1/8W 1% 0805 SMD; Source: Digikey; ROHS Certificate: ROHS-PANASONIC.pdf
R4 R11 R20 R28 R40 R112 R130 = RS/ERJ6ENF: RES 10.0K OHM 1/8W 1% 0805 SMD; Manufacturer: Panasonic - ECG; Manufacturer Part Number: ERJ-6ENF1002V; Source Part Number: P10.0KCCT-ND; Value: RES 10.0K OHM 1/8W 1% 0805 SMD; Source: Digikey; ROHS Certificate: ROHS-PANASONIC.pdf
R5 = RS/ERJ8ENF: RES 121 OHM 1/4W 1% 1206 SMD; Manufacturer: Panasonic - ECG; Manufacturer Part Number: ERJ-8ENF1210V; Source Part Number: P121FCT-ND; Value: RES 121 OHM 1/4W 1% 1206 SMD; Source: Digikey; ROHS Certificate: ROHS-PANASONIC.pdf
R7 R17 = RS/ERJ6ENF: RES 1.00K OHM 1/8W 1% 0805 SMD; Manufacturer: Yageo; Manufacturer Part Number: RC0805FR-071KL; Source Part Number: 311-1.00KCRCT-ND; Value: RES 1.00K OHM 1/8W 1% 0805 SMD; Source: Digikey; ROHS Certificate: ROHS-PANASONIC.pdf
R8 R22 R29 = RS/ERJ6GEYJ: RES 0.0 OHM 1/8W 5% 0805 SMD; Manufacturer: Panasonic - ECG; Manufacturer Part Number: ERJ-6GEY0R00V; Source Part Number: P0.0ACT-ND; Value: RES 0.0 OHM 1/8W 5% 0805 SMD; Source: Digikey; ROHS Certificate: ROHS-PANASONIC.pdf
R9 R128 = RS/ERJ6ENF: RES 3.16K OHM 1/8W 1% 0805 SMD; Manufacturer: Panasonic - ECG; Manufacturer Part Number: ERJ-6ENF3161V; Source Part Number: P3.16KCCT-ND; Value: RES 3.16K OHM 1/8W 1% 0805 SMD; Source: Digikey; ROHS Certificate: ROHS Certificate
R12 = RS/ERJ6ENF: RES 499 OHM 1/8W 1% 0805 SMD; Manufacturer: Panasonic - ECG; Manufacturer Part Number: ERJ-6ENF4990V; Source Part Number: P499CCT-ND; Value: RES 499 OHM 1/8W 1% 0805 SMD; Source: Digikey; ROHS Certificate: ROHS-PANASONIC.pdf
R13 = RS/ERJ6ENF: RES 3.32K OHM 1/8W 1% 0805 SMD; Manufacturer: Panasonic - ECG; Manufacturer Part Number: ERJ-6ENF3321V; Source Part Number: P3.32KCCT-ND; Value: RES 3.32K OHM 1/8W 1% 0805 SMD; Source: Digikey; ROHS Certificate: ROHS-PANASONIC.pdf
R15 = RS/ERJ6ENF: RES 47.5K OHM 1/8W 1% 0805 SMD; Manufacturer: Panasonic - ECG; Manufacturer Part Number: ERJ-6ENF4752V; Source Part Number: P47.5KCCT-ND; Value: RES 47.5K OHM 1/8W 1% 0805 SMD; Source: Digikey; ROHS Certificate: ROHS-PANASONIC.pdf
R16 R129 = RS/ERJ6ENF: RES 20.0K OHM 1/8W 1% 0805 SMD; Manufacturer: Panasonic - ECG; Manufacturer Part Number: ERJ-6ENF2002V; Source Part Number: P20.0KCCT-ND; Source: Digikey; ROHS Certificate: ROHS-PANASONIC.pdf; Value: RES 20.0K OHM 1/8W 1% 0805 SMD
R18 = RS/ERJ6ENF: RES 1.65K OHM 1/8W 1% 0805 SMD; Manufacturer Part Number: ERJ-6ENF1651V; Source Part Number: P1.65KCCT-ND; Manufacturer: Panasonic - ECG; Value: RES 1.65K OHM 1/8W 1% 0805 SMD; Source: Digikey; ROHS Certificate: ROHS Certificate
R24 = RS/ERJ6ENF: RES 7.50K OHM 1/8W 1% 0805 SMD; Manufacturer: Panasonic - ECG; Manufacturer Part Number: ERJ-6ENF7501V; Source Part Number: P7.50KCCT-ND; Value: RES 7.50K OHM 1/8W 1% 0805 SMD; Source: Digikey; ROHS Certificate: ROHS-PANASONIC.pdf
R25 = RS/ERJ6ENF: RES 2.49K OHM 1/8W 1% 0805 SMD; Manufacturer: Panasonic - ECG; Manufacturer Part Number: ERJ-6ENF2491V; Source Part Number: P2.49KCCT-ND; Value: RES 2.49K OHM 1/8W 1% 0805 SMD; Source: Digikey; ROHS Certificate: ROHS-PANASONIC.pdf
R46-R57 R88-R99 = RS/ERJ8ENF: RES 15.0 OHM 1/4W 1% 1206 SMD; Manufacturer: Panasonic - ECG; Manufacturer Part Number: ERJ-8ENF15R0V; Source Part Number: P15.0FTR-ND; Value: RES 15.0 OHM 1/4W 1% 1206 SMD; Source: Digikey; ROHS Certificate: ROHS-PANASONIC.pdf
  R88-R99: Value: Value
R58-R69 R100-R111 = RS/ERJ8ENF: RES 32.4 OHM 1/4W 1% 1206 SMD; Manufacturer: Panasonic - ECG; Manufacturer Part Number: ERJ-8ENF32R4V; Source Part Number: P32.4FTR-ND; Value: RES 32.4 OHM 1/4W 1% 1206 SMD; Source: Digikey; ROHS Certificate: ROHS-PANASONIC.pdf
  R100-R111: Value: Value
U1 U4 U8 U9 = IS/M25P64VMF6GZ: 64 MBit Serial SPI NOR FLASH; Manufacturer: STMicroelectronics / Numonyx; Manufacturer Part Number: M25P64-VMF6P; Source: Mouser; Source Part Number: M25P64-VMF6P; ROHS Certificate: ROHS-NUMONYX.pdf; Value: 64 MBit Serial SPI NOR FLASH
U2 = IS/DSPIC30F501320IPTZ_1: IC DSPIC MCU/DSP 144K 80TQFP; Manufacturer: Microchip Technology; Manufacturer Part Number: DSPIC30F6014A-30I/PT; Source Part Number: DSPIC30F6014A30IP-ND; Source: Digikey; ROHS Certificate: ROHS-MICROCHIP.pdf; Value: IC DSPIC MCU/DSP 144K 80TQFP
U3 = IS/SN65HVD230DRT: IC 3.3V CAN TXRX W/STNDBY 8-SOIC; Manufacturer: Texas Instruments; Source Part Number: SN65HVD230D-ND; Manufacturer Part Number: SN65HVD230DR; Source: Digikey; ROHS Certificate: ROHS-SN65HVD230DR.pdf; Value: IC 3.3V CAN TXRX W/STNDBY 8-SOIC
U5 = IS/CS4344CZZZ: IC DAC 24BIT 192KHZ 10-TSSOP; Manufacturer: Cirrus Logic Inc; Source Part Number: 598-1051-5-ND; Manufacturer Part Number: CS4344-CZZ; Source: Digikey; ROHS Certificate: ROHS-CIRRUS-LOGIC.pdf; Value: IC DAC 24BIT 192KHZ 10-TSSOP
U6 U11 = IS/LM2676SADJN: IC REG SIMPLE SWITCHER TO-263-7; Manufacturer: National Semiconductor; Source Part Number: LM2676S-ADJ-ND; Manufacturer Part Number: LM2676S-ADJ/NOPB; Source: Digikey; ROHS Certificate: ROHS-LM2676SD-ADJNOPB.pdf; Value: IC REG SIMPLE SWITCHER TO-263-
U7 = IS/LP2950CDT33N: IC REG VOLT MICROPWR 3.3V TO-252; Manufacturer: National Semiconductor; Manufacturer Part Number: LP2950CDT-3.3/NOPB; Source Part Number: LP2950CDT-3.3-ND; Source: Digikey; ROHS Certificate: ROHS-LP2950CDT-3.3NOPB.pdf; Value: IC REG VOLT MICROPWR 3.3V TO-252
U10 = LM4861M: IC AMP AUDIO PWR W/SHUTDN 8-SOIC; Manufacturer: National Semiconductor; Source Part Number: LM4861M-ND; Manufacturer Part Number: LM4861M; Source: Digikey; ROHS Certificate: ROHS-NATIONAL.pdf; Value: IC AMP AUDIO PWR W/SHUTDN 8-SOIC
U12 = I#S/MOCD207MZ: OPTOCOUPLER TRANS-OUT 2CH 8-SOIC; Manufacturer: Fairchild Optoelectronics Group; Source Part Number: MOCD207M-ND; Manufacturer Part Number: MOCD207M; Source: Digikey; ROHS Certificate: ROHS-FAIRCHILD.pdf; Value: OPTOCOUPLER TRANS-OUT 2CH 8-SOIC
U13 = I#S/SN74AHC1G125DBVT: TI Tri State Buffer Single Gate; Manufacturer: Texas Instruments; Source Part Number: 296-8744-1-ND; Manufacturer Part Number: SN74AHC1G125DBVR; Source: Digikey; ROHS Certificate: ROHS-TI.pdf; Value: SN74AHC1G125DBVR
U14 = CP2102: Source Part Number: 336-1160-ND; Manufacturer: Silicon Laboratories Inc; Manufacturer Part Number: CP2102-GM; Value: CP2102; Source: Digikey
Y1 = ZS/ECS1228205PTRZ: CRYSTAL 8.192MHZ 18PF FUND SMD; Manufacturer: Abracon Corporation; Manufacturer Part Number: ABLS-8.192MHZ-B2-T; Source Part Number: 535-9090-1-ND; Source: Digikey; ROHS Certificate: ROHS-ABRACON.pdf; Value: CRYSTAL 8.192MHZ 18PF FUND SMD
FID1-FID8 = Fiducial: Manufacturer: Manufacturer; Manufacturer Part Number: Manufacturer Part Number; Source: Source; Source Part Number: Source Part Number; ROHS Certificate: ROHS Certificate; Value: Value